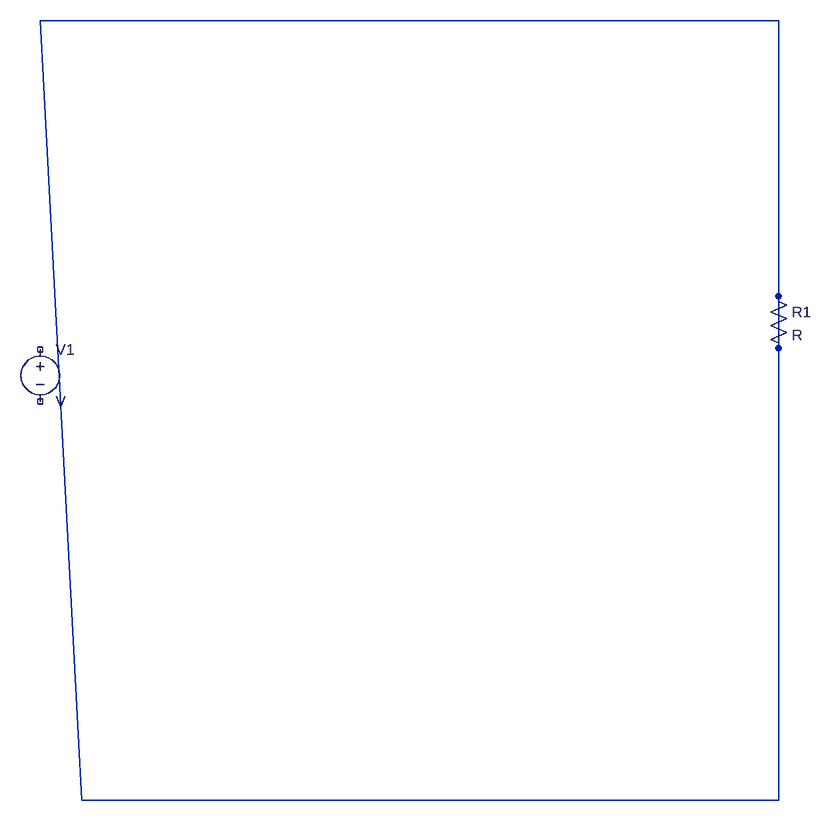
[diagram p0: schematic C5_D2_P2.jpg.asc]
C5_D2_P2.jpg.asc, the LTspice schematic file:
Version 4
SHEET 1 880 680
SYMBOL res 1872 2008 R0
SYMATTR InstName R1
SYMBOL voltage 752 2090 R0
SYMATTR InstName V1
WIRE 752 1600 816 2800
WIRE 816 2800 1888 2800
WIRE 752 1600 1888 1600
WIRE 1888 1600 1888 2800

The netlist it stands for:
* C5_D2_P2.jpg.asc
R1 N001 N001 R
V1 NC_01 NC_02 V
.backanno
.end